# EAGLE schematic schema_dubbellayer (EAGLE 6.4)
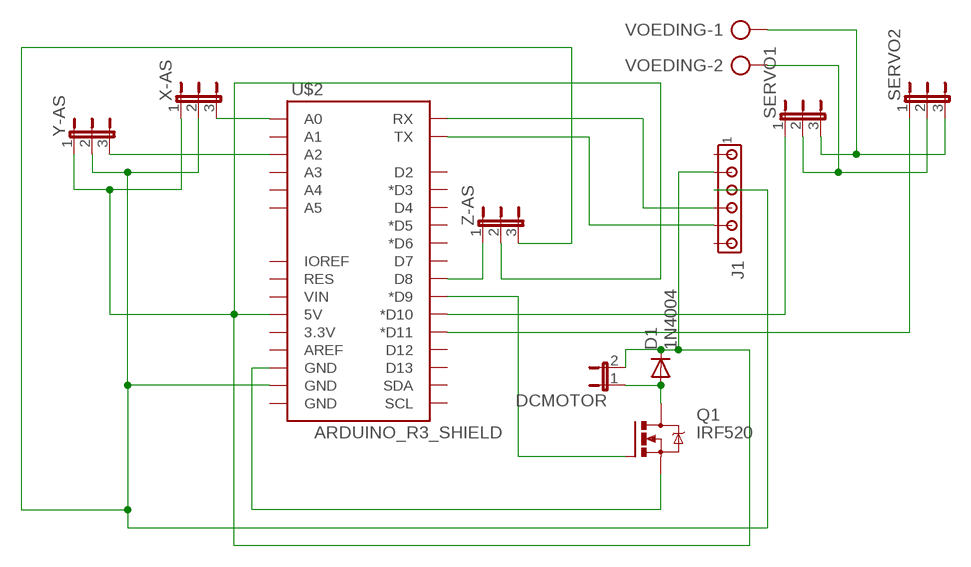
[diagram p0: schematic, sheet 1]

## Parts
D1  1N4004  [DO41-10]
DCMOTOR  JP1E  [JP1]
J1  MTA06-100  [10X06MTA]
Q1  IRF520  [TO220BV]
SERVO1  JP2E  [JP2]
SERVO2  JP2E  [JP2]
U$2  ARDUINO_R3_SHIELD  [UNO_R3_SHIELD]
VOEDING  AK300/2  [AK300/2]
X-AS  JP2E  [JP2]
Y-AS  JP2E  [JP2]
Z-AS  JP2E  [JP2]

## Nets
N$1: U$2.A0 X-AS.3
N$2: U$2.A2 Y-AS.3
N$3: D1.A DCMOTOR.1 Q1.D
N$4: J1.4 U$2.GND@1(GND) X-AS.2 Y-AS.2 Z-AS.3
N$5: Q1.G U$2.D9(*D9)
N$6: Q1.S U$2.GND@2(GND)
N$7: U$2.D8 Z-AS.1
N$8: SERVO1.1 U$2.D10(*D10)
N$9: SERVO2.1 U$2.D11(*D11)
N$11: D1.C DCMOTOR.2 J1.5 U$2.5V X-AS.1 Y-AS.1 Z-AS.2
N$12: SERVO1.2 SERVO2.2 VOEDING.2
N$13: SERVO1.3 SERVO2.3 VOEDING.1
N$15: J1.2 U$2.TX
N$16: J1.3 U$2.RX
Unconnected: J1.1 J1.6 U$2.3.3V U$2.A1 U$2.A3 U$2.A4 U$2.A5 U$2.AREF U$2.D2 U$2.D3(*D3) U$2.D4 U$2.D5(*D5) U$2.D6(*D6) U$2.D7 U$2.D12 U$2.D13 U$2.GND@0(GND) U$2.IOREF U$2.RES U$2.SCL U$2.SDA U$2.VIN

## Library data of the parts
D1 = diode:1N4004: DIODE general purpose rectifier, 1 A
DCMOTOR = jumper:JP1E: JUMPER
J1 = con-amp:MTA06-100: AMP connector
Q1 = transistor-power:IRF520: HEXFET Power MOSFET
SERVO1 SERVO2 X-AS Y-AS Z-AS = jumper:JP2E: JUMPER
U$2 = SparkFun-Boards:ARDUINO_R3_SHIELD: Shield form compatible with the Arduino Uno R3.
VOEDING = con-ptr500:AK300/2: CONNECTOR; OC_FARNELL: unknown; OC_NEWARK: unknown